# Altium schematic sheet 01_Power.SchDoc: Наименование
size 420 x 297 mm; Name: Наименование; ApprovedBy: Сергеева А.А.; CheckedBy: Рогозин А.А.; Author: Кузнецов М.Д.; CompanyName: МГТУ им. Баумана; DocumentNumber: 2; SheetNumber: 1; SheetTotal: 6; PageSetup: Record=PageOptions|CenterHorizontal=True|CenterVertical=True|PrintScale=0.94|XCorrection=1.00|YCorrection=1.00|PrintKind=1|BorderSize=5000000|LeftOffset=0|BottomOffset=0|Orientation=1|PaperLength=1000|PaperWidth=1000|Scale=100|PaperSource=7|PrintQuality=-4|MediaType=1|DitherType=10|PaperKind=A4|PrintScaleMode=1; DecimalNumber: МГТУ.468784.001; HeadOfSector: Нач. сектора; MainDevice: Перв.примен.; Name1: Плата расширения; n_kontr: Н. Контр; t_kontr: Т. Контр; lit_A: О; Name2: для отладочного модуля; DocumentName: Sheet1.SCHDOC
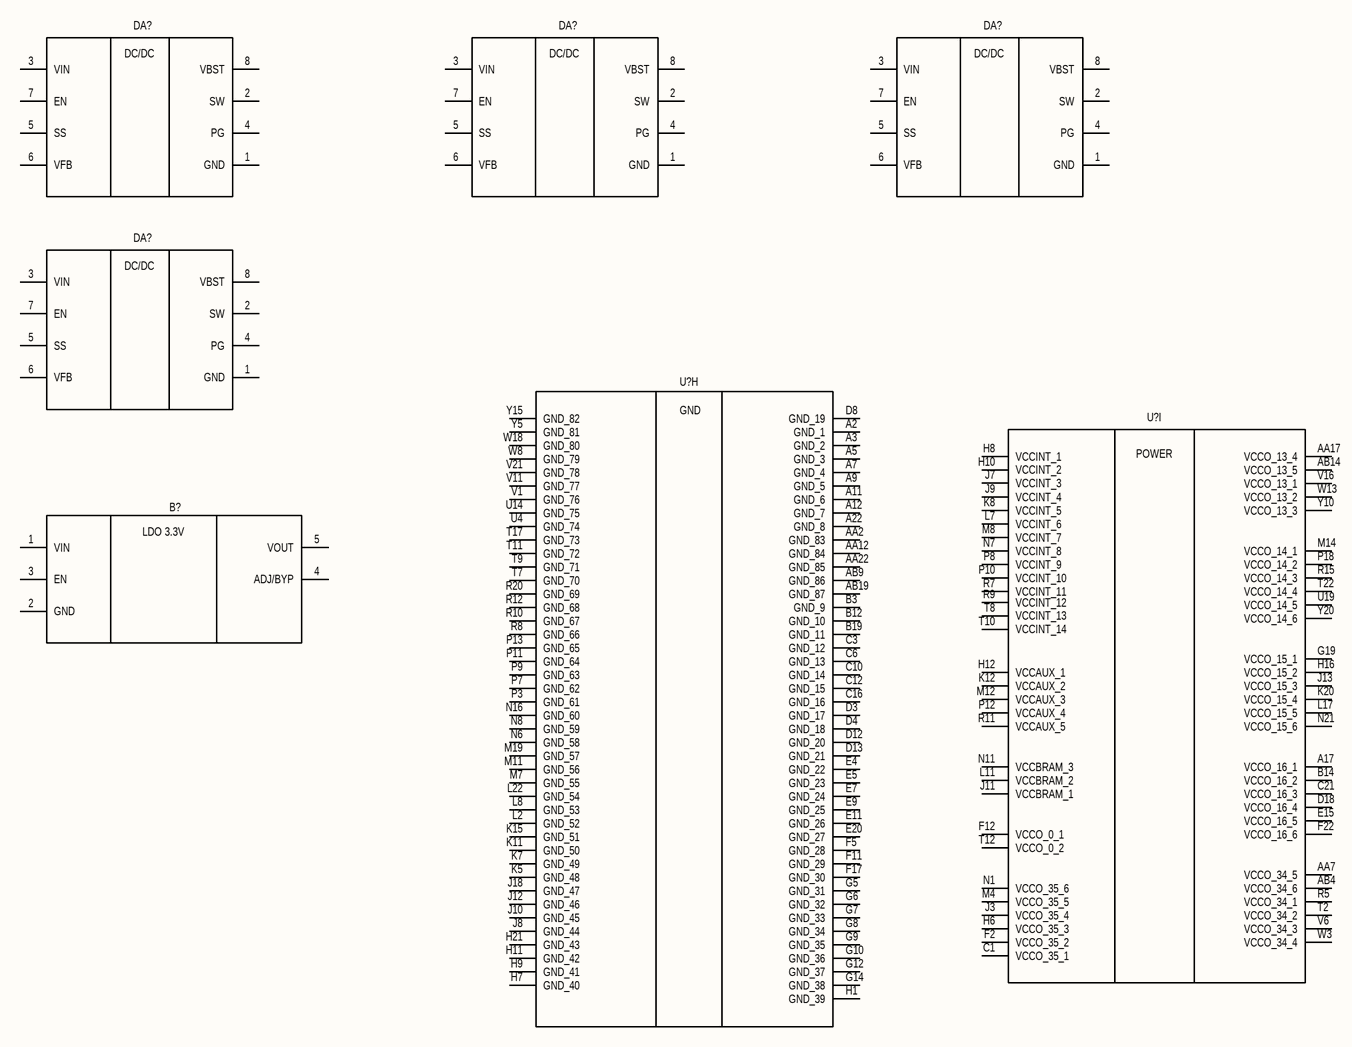
[diagram p0: 01_Power.SchDoc]

## Parts
(Parts that share a designator on the sheet are numbered #1, #2 ... from top to bottom, then left to right.)
B?  SPX3819M5-L-3-3  [SOT95P280X145-5N]  (value not drawn)
DA?#1  TPS563210A  [SOT65P280X110-8N]  (value not drawn)
DA?#2  TPS563210A  [SOT65P280X110-8N]  (value not drawn)
DA?#3  TPS563210A  [SOT65P280X110-8N]  (value not drawn)
DA?#4  TPS563210A  [SOT65P280X110-8N]  (value not drawn)
U?#1  XC7A50T-2FGG484I  [BGA484C100P22X22_2300X2300X260]  (value not drawn)  (part H of 10)
U?#2  XC7A50T-2FGG484I  [BGA484C100P22X22_2300X2300X260]  (value not drawn)  (part I of 10)

## Nets

Not connected (* = marked no-connect by the designer): B? 1(VIN) 2(GND) 3(EN) 4(ADJ/BYP) 5(VOUT); DA?#1 1(GND) 2(SW) 3(VIN) 4(PG) 5(SS) 6(VFB) 7(EN) 8(VBST); DA?#2 1(GND) 2(SW) 3(VIN) 4(PG) 5(SS) 6(VFB) 7(EN) 8(VBST); DA?#3 1(GND) 2(SW) 3(VIN) 4(PG) 5(SS) 6(VFB) 7(EN) 8(VBST); DA?#4 1(GND) 2(SW) 3(VIN) 4(PG) 5(SS) 6(VFB) 7(EN) 8(VBST); U?#1 A2(GND_1) A3(GND_2) A5(GND_3) A7(GND_4) A9(GND_5) A11(GND_6) A12(GND_7) A22(GND_8) AA2(GND_83) AA12(GND_84) AA22(GND_85) AB9(GND_86) AB19(GND_87) B3(GND_9) B12(GND_10) B19(GND_11) C3(GND_12) C6(GND_13) C10(GND_14) C12(GND_15) C16(GND_16) D3(GND_17) D4(GND_18) D8(GND_19) D12(GND_20) D13(GND_21) E4(GND_22) E5(GND_23) E7(GND_24) E9(GND_25) E11(GND_26) E20(GND_27) F5(GND_28) F11(GND_29) F17(GND_30) G5(GND_31) G6(GND_32) G7(GND_33) G8(GND_34) G9(GND_35) G10(GND_36) G12(GND_37) G14(GND_38) H1(GND_39) H7(GND_40) H9(GND_41) H11(GND_42) H21(GND_43) J8(GND_44) J10(GND_45) J12(GND_46) J18(GND_47) K5(GND_48) K7(GND_49) K11(GND_50) K15(GND_51) L2(GND_52) L8(GND_53) L22(GND_54) M7(GND_55) M11(GND_56) M19(GND_57) N6(GND_58) N8(GND_59) N16(GND_60) P3(GND_61) P7(GND_62) P9(GND_63) P11(GND_64) P13(GND_65) R8(GND_66) R10(GND_67) R12(GND_68) R20(GND_69) T7(GND_70) T9(GND_71) T11(GND_72) T17(GND_73) U4(GND_74) U14(GND_75) V1(GND_76) V11(GND_77) V21(GND_78) W8(GND_79) W18(GND_80) Y5(GND_81) Y15(GND_82); U?#2 A17(VCCO_16_1) AA7(VCCO_34_5) AA17(VCCO_13_4) AB4(VCCO_34_6) AB14(VCCO_13_5) B14(VCCO_16_2) C1(VCCO_35_1) C21(VCCO_16_3) D18(VCCO_16_4) E15(VCCO_16_5) F2(VCCO_35_2) F12(VCCO_0_1) F22(VCCO_16_6) G19(VCCO_15_1) H6(VCCO_35_3) H8(VCCINT_1) H10(VCCINT_2) H12(VCCAUX_1) H16(VCCO_15_2) J3(VCCO_35_4) J7(VCCINT_3) J9(VCCINT_4) J11(VCCBRAM_1) J13(VCCO_15_3) K8(VCCINT_5) K12(VCCAUX_2) K20(VCCO_15_4) L7(VCCINT_6) L11(VCCBRAM_2) L17(VCCO_15_5) M4(VCCO_35_5) M8(VCCINT_7) M12(VCCAUX_3) M14(VCCO_14_1) N1(VCCO_35_6) N7(VCCINT_8) N11(VCCBRAM_3) N21(VCCO_15_6) P8(VCCINT_9) P10(VCCINT_10) P12(VCCAUX_4) P18(VCCO_14_2) R5(VCCO_34_1) R7(VCCINT_11) R9(VCCINT_12) R11(VCCAUX_5) R15(VCCO_14_3) T2(VCCO_34_2) T8(VCCINT_13) T10(VCCINT_14) T12(VCCO_0_2) T22(VCCO_14_4) U19(VCCO_14_5) V6(VCCO_34_3) V16(VCCO_13_1) W3(VCCO_34_4) W13(VCCO_13_2) Y10(VCCO_13_3) Y20(VCCO_14_6)

## Notes on the sheet
- Перв.примен.
- Справ.№
- Подп. и дата
- Инв.№ дубл.
- Взам.инв.№
- Подп.и дата
- Разраб.
- Изм.
- Лист
- № докум.
- Подп.
- Дата
- Лит.
- Масштаб
- Масса
- Т.контр.
- Пров.
- СХЕМА   ЭЛЕКТРИЧЕСКАЯ
- ПРИНЦИПИАЛЬНАЯ
- Листов
- Инв.№ подл.
- Утв.
- Н.контр.
- Нач.сект.
- Формат  A3
- (in symbol SPX3819M5-L-3-3) LDO 3.3V
- (in symbol TPS563210A) DC/DC
- (in symbol XC7A50T-2FGG484I, part H) GND
- (in symbol XC7A50T-2FGG484I, part I) POWER

## Library data of the parts
B? = SPX3819M5-L-3-3: IC REG LINEAR 3.3V 500MA SOT23-5; Manufacturer_Name: MaxLinear, Inc.; Geometry.Height: 1.45mm; Manufacturer_Part_Number: SPX3819M5-L-3-3; Mouser Part Number: 701-SPX3819M5-L-3-3; Mouser Price/Stock: https://www.mouser.co.uk/ProductDetail/MaxLinear/SPX3819M5-L-3-3?qs=2Z08r0Wtf%2Fyl32mFDRYBCg%3D%3D; Arrow Part Number: *; Arrow Price/Stock: *; Datasheet Link: https://componentsearchengine.com/Datasheets/2/SPX3819M5-L-3-3.pdf
DA?#1-DA?#4 = TPS563210A: Texas Instruments TPS563210A synchronous buck regulator, DDF 8-pin; custom GOST-style schematic symbol; OrderingSuffix: DDFR/DDFT packaging not selected; Manufacturer: Texas Instruments; MPN: TPS563210A; Package: DDF; Datasheet: https://www.ti.com/lit/ds/symlink/tps563210a.pdf; Source: TI datasheet pin functions page 3; user-requested native symbol
U?#1 U?#2 = XC7A50T-2FGG484I: FPGA - Field Programmable Gate Array XC7A50T-2FGG484I; Manufacturer_Name: AMD; Geometry.Height: 2.6mm; Manufacturer_Part_Number: XC7A50T-2FGG484I; Mouser Part Number: 217-XC7A50T-2FGG484I; Mouser Price/Stock: https://www.mouser.co.uk/ProductDetail/Xilinx/XC7A50T-2FGG484I?qs=rrS6PyfT74djoRso%252BOe%2F9Q%3D%3D; Arrow Part Number: *; Arrow Price/Stock: *; Datasheet Link: https://www.xilinx.com/support/documentation/data_sheets/ds181_Artix_7_Data_Sheet.pdf